# EAGLE design bigbro (EAGLE 7.2.0)
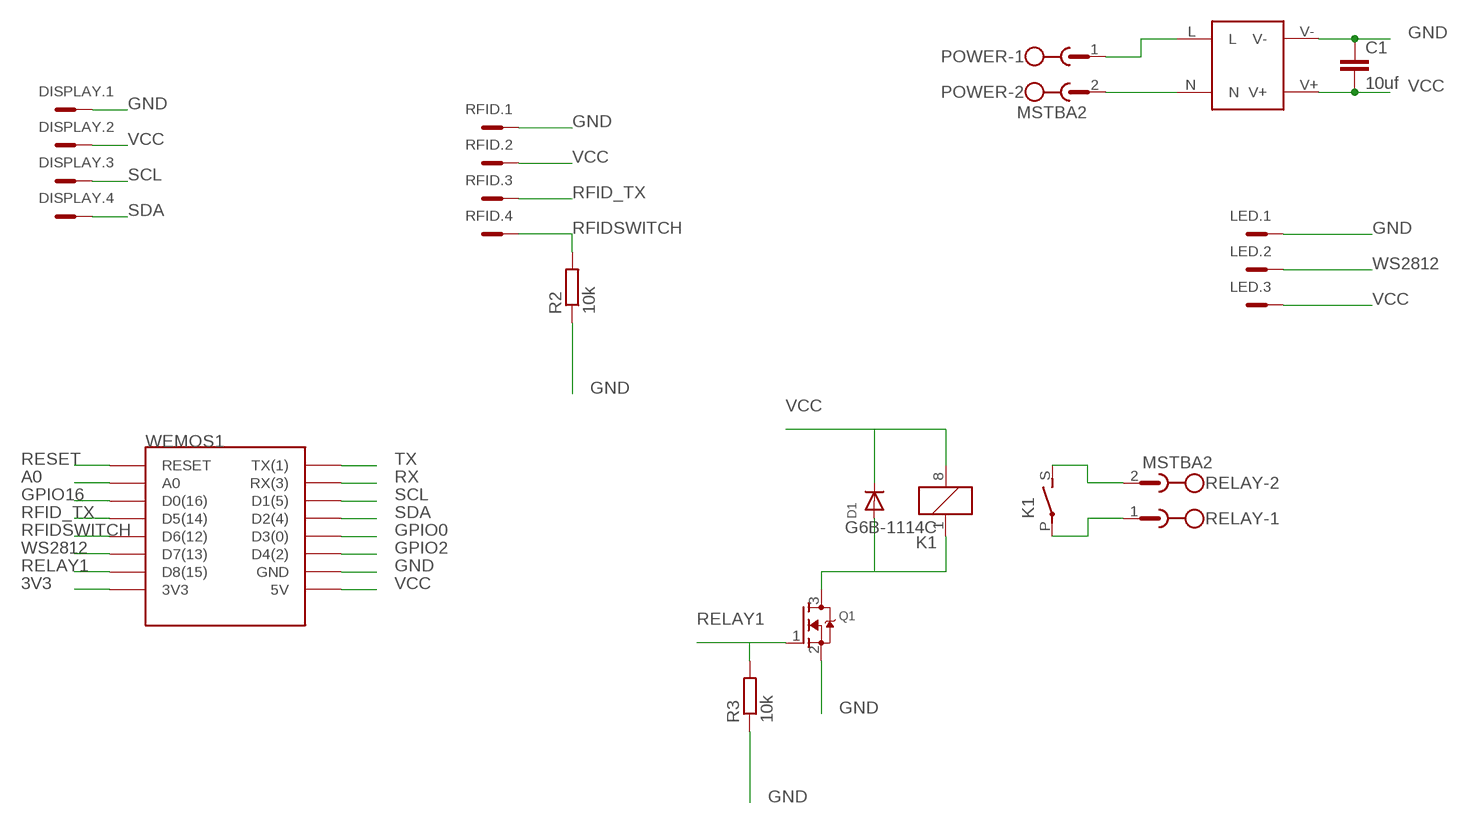
[diagram p0: schematic, sheet 1]

## Parts
C1  10uf  C-EUC0805  [C0805]
D1  DIODESMA  [SMADIODE]
DISPLAY  MC4  [MC4]
K1  G6B-1114C  [G6B-1114C]
LED  MC3  [MC3]
POWER  MSTBA2  [MSTBA2]
Q1  MOSFET-NREFLOW  [SOT23]
R2  10k  R-EU_M0805  [M0805]
R3  10k  R-EU_M0805  [M0805]
RELAY  MSTBA2  [MSTBA2]
RFID  MC4  [MC4]
U$1  HLK-PM03  [HLK-PM03]
WEMOS1  WEMOS-D1-MINI  [WEMOS-D1-MINI]

## Nets
3V3: WEMOS1.3V3
A0: WEMOS1.A0
GND: C1.1 DISPLAY.1 LED.1 Q1.2(S) R2.1 R3.1 RFID.1 U$1.V- WEMOS1.GND
GPIO0: WEMOS1.D3(D3(0))
GPIO2: WEMOS1.D4(D4(2))
GPIO16: WEMOS1.D0(D0(16))
N$26: POWER.1 U$1.L
N$27: POWER.2 U$1.N
N$28: K1.S(2:S) RELAY.2
N$29: K1.P(2:P) RELAY.1
N$30: D1.A K1.1 Q1.3(D)
RELAY1: Q1.1(G) R3.2 WEMOS1.D8(D8(15))
RESET: WEMOS1.RESET
RFID_TX: RFID.3 WEMOS1.D5(D5(14))
RFIDSWITCH: R2.2 RFID.4 WEMOS1.D6(D6(12))
RX: WEMOS1.RX(RX(3))
SCL: DISPLAY.3 WEMOS1.D1(D1(5))
SDA: DISPLAY.4 WEMOS1.D2(D2(4))
TX: WEMOS1.TX(TX(1))
VCC: C1.2 D1.C DISPLAY.2 K1.8 LED.3 RFID.2 U$1.V+ WEMOS1.5V
WS2812: LED.2 WEMOS1.D7(D7(13))

## Library data of the parts
C1 = rcl:C-EU: CAPACITOR, European symbol
D1 = adafruit:DIODE: Diode SMADIODE - SMA Surface Mount Package 20V 1A Schottky Diode Digikey: 641-1014-6-ND DO-1N4148 - Through Hole Small Current Diode SOD-123 20V 1 A (.5mV Vf) Schottky Diode - Digikey: MBRX120TPMSCT-ND SOD-323 10V 570mA (.38mV Vf, 3ns) Schottky Diode - Digikey: ZLLS410CT-ND SOD-523 30V 30mA Schottky Diode (RB751S-40TE61) - Digikey: RB751S-40TE61CT-ND SOT23-R/W - SOT23 Package (R = Solder Paste/Reflow Ovens, W = Hand-Soldering) BAT54Film 40V 300mA - Digikey: 497-7162-1-ND
DISPLAY RFID = con-phoenix-381_l:MC4: Mini-Combicon 3.81mm horizontal 4-polig MC 1,5/4-G-3,81 Artikel-Nr. 1803293
K1 = mylib:G6B-1114C: RELAY 1 x norm. open, 10 A/240 V, Omron; OC_FARNELL: unknown; OC_NEWARK: unknown
LED = con-phoenix-381_l:MC3: Mini-Combicon 3.81mm horizontal 3-polig MC 1,5/3-G-3,81 Artikel-Nr. 1803280
POWER RELAY = con-phoenix-508:MSTBA2: PHOENIX; MF: FARNELL; MPN: 1757242; OC_FARNELL: 3705171; OC_NEWARK: 71C4161
Q1 = adafruit:MOSFET-N: N-Channel Mosfet 2N7002E - 60V 260mA SOT23 [Digikey: 2N7002ET1GOSTR-ND] - REEL BSH103 - 30V 850mA SOT23 [Digikey: 568-5013-1-ND]
R2 R3 = rcl:R-EU_: RESISTOR, European symbol
U$1 = mylib:HLK-PM03
WEMOS1 = esp8266modules:WEMOS-D1-MINI: WeMos.cc D1 mini ESP8266 module

## Board
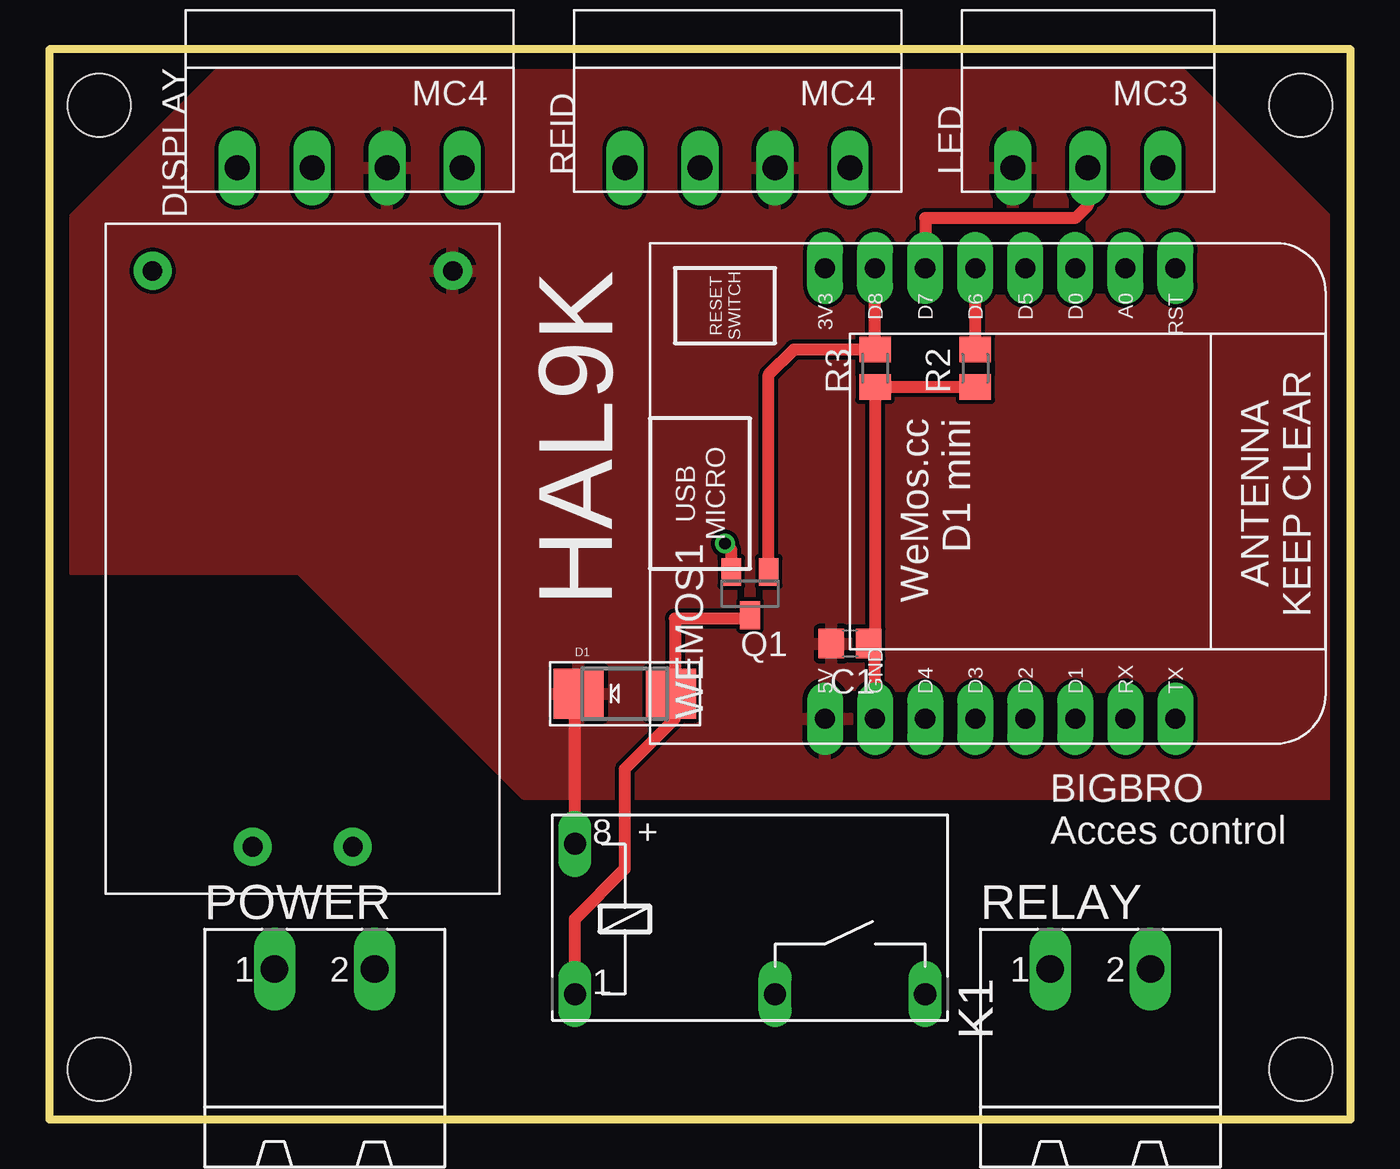
[diagram p1: board, top side]
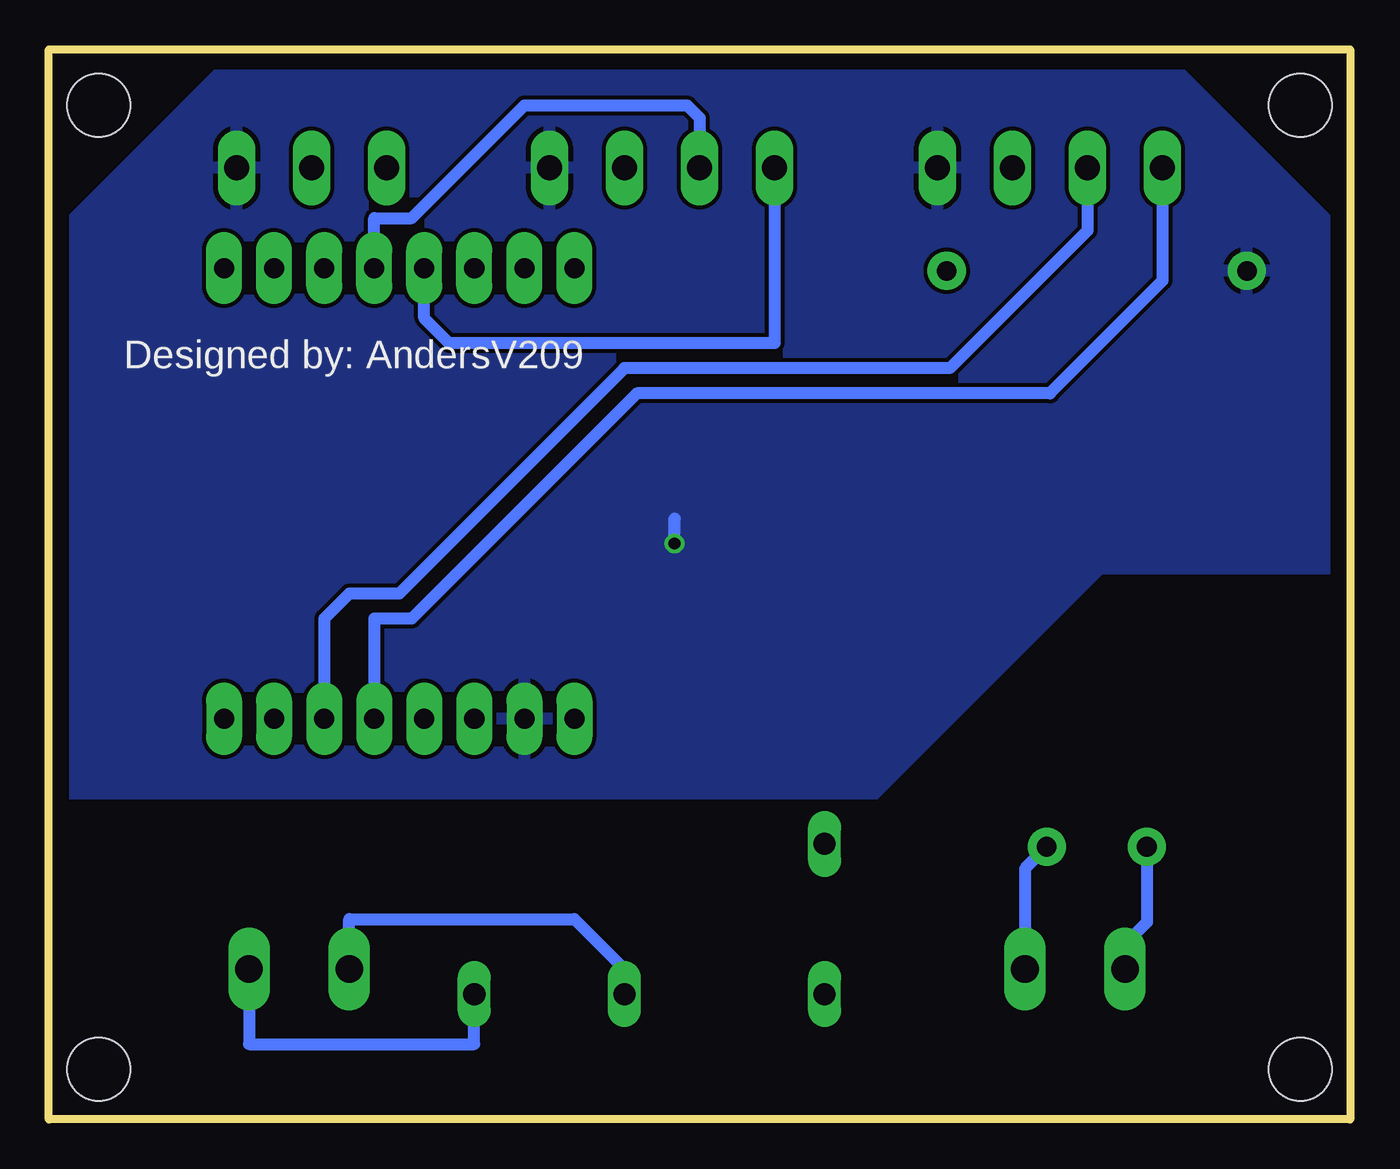
[diagram p2: board, bottom side, seen from below]

Size 66.02 x 54.28 mm. Coordinates in mm from the lower left corner, seen from the top.
Outline: 0,0 66.02,0 66.02,54.28 0,54.28 0,0
Copper layers (1*16): Top 0.035mm / dielectric 1.5mm / Bottom 0.035mm
Design rules "default *": minimum track width 24mil, minimum drill 24mil, track to track 8mil, track to pad 8mil, pad to pad 8mil, via to via 8mil, smd to smd 8mil, copper to edge 40mil, drill to drill 8mil, minimum pad ring 10mil, minimum via ring 8mil, stop-mask expansion 4mil, vias tented up to drill 0mil, thermal gap 10mil
Holes 3.2 mm at 2.54,2.54 63.5,2.54 63.5,51.44 2.54,51.44
Milling: 4 lines

### Footprints (pad centres in the part's own frame; a part is rotated, then mirrored left to right if it is on the bottom)
C0805 = smd 1.3 x 1.5: 1 -0.95,0; 2 0.95,0
SMADIODE = smd 2.54 x 2.54: A 2.349,0; C -2.349,0
MC4 = drill 1.27 long: 1 -5.715,0; 2 -1.905,0; 3 1.905,0; 4 5.715,0
G6B-1114C = drill 1.118 long: 1 -8.89,-5.08; 8 -8.89,2.54; P 1.27,-5.08; S 8.89,-5.08
MC3 = drill 1.27 long: 1 -3.81,0; 2 0,0; 3 3.81,0
MSTBA2 = drill 1.397 long: 1 -2.54,5.08; 2 2.54,5.08
SOT23 = smd 1 x 1.4: 1 -0.95,-1.1; 2 0.95,-1.1; 3 0,1.1
M0805 = smd 1.3 x 1.6: 1 -0.95,0; 2 0.95,0
HLK-PM03 = drill 1 pad 1.93: L 2.395,12.54; N 2.395,7.46; V+ 31.605,2.38; V- 31.605,17.62
WEMOS-D1-MINI = drill 1.016 pad 1.829 long: 3V3 -10.16,-10.16; 5V 12.7,-10.16; A0 -10.16,5.08; D0 -10.16,2.54; D1 12.7,2.54; D2 12.7,0; D3 12.7,-2.54; D4 12.7,-5.08; D5 -10.16,0; D6 -10.16,-2.54; D7 -10.16,-5.08; D8 -10.16,-7.62; GND 12.7,-7.62; RESET -10.16,7.62; RX 12.7,5.08; TX 12.7,7.62

### Placement (x,y rotation side)
C1  40.64,24.13 180 top
D1  29.21,21.59 0 top
DISPLAY  15.24,48.26 180 top
K1  35.56,11.43 0 top
LED  52.7,48.26 180 top
POWER  13.97,2.54 0 top
Q1  35.56,26.67 180 top
R2  46.99,38.1 90 top
R3  41.91,38.1 90 top
RELAY  53.34,2.54 0 top
RFID  34.92,48.26 180 top
U$1  22.86,11.43 90 top
WEMOS1  49.53,33.02 270 top

### Tracks (layer width: path | path; a pad name or v marks a point on that pad's centre or on a via)
GND  (via drill 0.6)
  Top 0.61: R2.1 R3.1 41.91,24.45 C1.1 41.91,23.81 WEMOS1.GND | Q1.2 34.61,28.89 v34.29,29.21
  Bottom 0.61: v34.29,29.21 34.29,30.48
  pour Bottom: 0,27.94 12.7,27.94 24.13,16.51 66.04,16.51 66.04,44.45 55.88,54.61 10.16,54.61 0,44.45
N$26
  Bottom 0.61: U$1.L 10.32,10 11.43,8.89 POWER.1
N$27
  Bottom 0.61: U$1.N 16.51,12.7 POWER.2
N$28
  Bottom 0.61: RELAY.2 55.88,3.81 44.45,3.81 K1.S
N$29
  Bottom 0.61: RELAY.1 50.8,10.16 39.37,10.16 36.83,7.62 K1.P
N$30
  Top 0.61: Q1.3 35.56,25.4 31.75,25.4 31.75,21.59 D1.A 31.75,21.4 31.75,20.32 29.21,17.78 29.21,12.7 26.67,10.16 K1.1
RELAY1
  Top 0.61: WEMOS1.D8 R3.2 37.78,39.05 36.51,37.78 Q1.1
RFID_TX
  Bottom 0.61: WEMOS1.D5 49.53,45.72 47.62,45.72 41.91,51.44 33.66,51.44 33.02,50.8 RFID.3
RFIDSWITCH
  Top 0.61: R2.2 WEMOS1.D6
  Bottom 0.61: RFID.4 29.21,39.37 45.72,39.37 46.99,40.64 WEMOS1.D6
SCL
  Bottom 0.61: DISPLAY.3 13.34,45.09 20.32,38.1 36.83,38.1 48.26,26.67 50.8,26.67 52.07,25.4 WEMOS1.D1
SDA
  Bottom 0.61: DISPLAY.4 9.53,42.55 15.24,36.83 36.2,36.83 47.62,25.4 49.53,25.4 WEMOS1.D2
VCC
  Top 0.61: K1.8 26.67,21.4 D1.C
  pour Top: 0,27.94 12.7,27.94 24.13,16.51 66.04,16.51 66.04,44.45 55.88,54.61 10.16,54.61 0,44.45
WS2812
  Top 0.61: LED.2 52.7,46.35 52.07,45.72 44.45,45.72 WEMOS1.D7

### Text on the board
tNames: HAL9K | BIGBRO / Acces control
bNames: Designed by: AndersV209